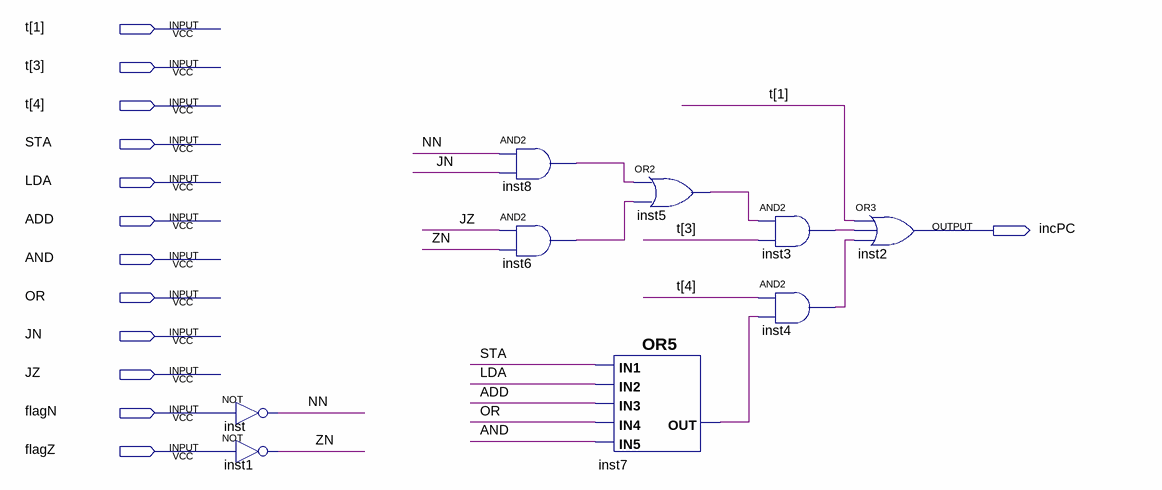
[diagram p0: schematic sheet]
// Quartus schematic incPC_logic.bdf as structural Verilog: 9 symbols, 13 pins
module incPC_logic (
  input  [4:1] t,
  input  STA,
  input  LDA,
  input  ADD,
  input  AND,
  input  OR,
  input  JN,
  input  JZ,
  input  flagN,
  input  flagZ,
  output incPC
);

  wire inst3_out, inst4_out, inst5_out, inst6_out, inst7_out, inst8_out, NN, ZN;

  not inst (NN, flagN);
  not inst1 (ZN, flagZ);
  and inst8 (inst8_out, NN, JN);
  and inst6 (inst6_out, JZ, ZN);
  or inst5 (inst5_out, inst8_out, inst6_out);
  or inst7 (inst7_out, STA, LDA, ADD, OR, AND);
  and inst3 (inst3_out, inst5_out, t[3]);
  and inst4 (inst4_out, t[4], inst7_out);
  or inst2 (incPC, t[1], inst3_out, inst4_out);
endmodule
